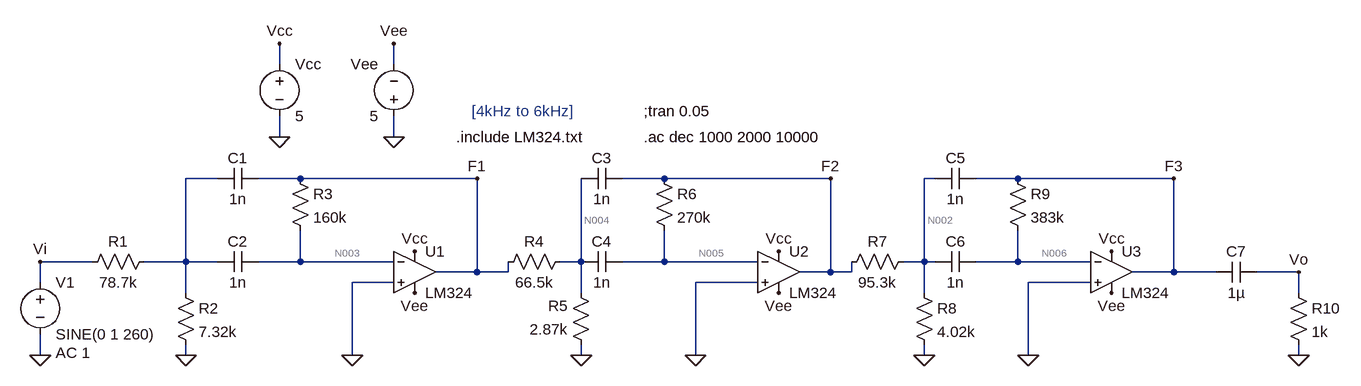
[diagram p0: schematic FinalPresenceFilter.asc]
FinalPresenceFilter.asc, the LTspice schematic file:
Version 4
SHEET 1 1524 680
WIRE -112 -160 -112 -192
WIRE 64 -160 64 -192
WIRE -112 -48 -112 -80
WIRE 64 -48 64 -80
WIRE -208 16 -256 16
WIRE -80 16 -144 16
WIRE 192 16 -80 16
WIRE 480 16 416 16
WIRE 736 16 480 16
WIRE 896 16 880 16
WIRE 1024 16 960 16
WIRE 1264 16 1024 16
WIRE -400 144 -480 144
WIRE -256 144 -256 16
WIRE -256 144 -320 144
WIRE -208 144 -256 144
WIRE -80 144 -80 96
WIRE -80 144 -144 144
WIRE 64 144 -80 144
WIRE 352 144 352 16
WIRE 352 144 320 144
WIRE 480 144 480 96
WIRE 480 144 416 144
WIRE 624 144 480 144
WIRE 880 144 880 16
WIRE 880 144 848 144
WIRE 896 144 880 144
WIRE 1024 144 1024 96
WIRE 1024 144 960 144
WIRE 1136 144 1024 144
WIRE 192 160 192 16
WIRE 192 160 128 160
WIRE 240 160 240 144
WIRE 240 160 192 160
WIRE 736 160 736 16
WIRE 736 160 688 160
WIRE 768 160 768 144
WIRE 768 160 736 160
WIRE 1264 160 1264 16
WIRE 1264 160 1200 160
WIRE 1328 160 1264 160
WIRE 1456 160 1392 160
WIRE -480 176 -480 144
WIRE 64 176 0 176
WIRE 624 176 528 176
WIRE 1136 176 1040 176
WIRE -256 192 -256 144
WIRE 352 192 352 144
WIRE 880 192 880 144
WIRE 1456 192 1456 160
WIRE -480 288 -480 256
WIRE -256 288 -256 272
WIRE 0 288 0 176
WIRE 352 288 352 272
WIRE 528 288 528 176
WIRE 880 288 880 272
WIRE 1040 288 1040 176
WIRE 1456 288 1456 272
FLAG 528 288 0
FLAG -480 288 0
FLAG 192 16 F1
FLAG 736 16 F2
FLAG -480 144 Vi
FLAG 1040 288 0
FLAG 1264 16 F3
FLAG 880 288 0
FLAG 352 288 0
FLAG -256 288 0
FLAG 0 288 0
FLAG -112 -192 Vcc
FLAG -112 -48 0
FLAG 64 -48 0
FLAG 64 -192 Vee
FLAG 96 192 Vee
FLAG 96 128 Vcc
FLAG 656 192 Vee
FLAG 656 128 Vcc
FLAG 1168 192 Vee
FLAG 1168 128 Vcc
FLAG 1456 288 0
FLAG 1456 160 Vo
SYMBOL res -304 128 R90
WINDOW 0 0 56 VBottom 2
WINDOW 3 32 56 VTop 2
SYMATTR InstName R1
SYMATTR Value 78.7k
SYMBOL voltage -480 160 R0
WINDOW 123 24 124 Left 2
WINDOW 39 0 0 Left 0
SYMATTR Value2 AC 1
SYMATTR InstName V1
SYMATTR Value SINE(0 1 260)
SYMBOL res -96 0 R0
SYMATTR InstName R3
SYMATTR Value 160k
SYMBOL res 336 128 R90
WINDOW 0 0 56 VBottom 2
WINDOW 3 32 56 VTop 2
SYMATTR InstName R4
SYMATTR Value 66.5k
SYMBOL res 368 288 R180
WINDOW 0 36 76 Left 2
WINDOW 3 36 40 Left 2
SYMATTR InstName R5
SYMATTR Value 2.87k
SYMBOL res 464 0 R0
SYMATTR InstName R6
SYMATTR Value 270k
SYMBOL res 752 160 R270
WINDOW 0 32 56 VTop 2
WINDOW 3 0 56 VBottom 2
SYMATTR InstName R7
SYMATTR Value 95.3k
SYMBOL res 864 176 R0
SYMATTR InstName R8
SYMATTR Value 4.02k
SYMBOL res 1008 0 R0
SYMATTR InstName R9
SYMATTR Value 383k
SYMBOL cap -144 0 R90
WINDOW 0 0 32 VBottom 2
WINDOW 3 32 32 VTop 2
SYMATTR InstName C1
SYMATTR Value 1n
SYMBOL cap -144 128 R90
WINDOW 0 0 32 VBottom 2
WINDOW 3 32 32 VTop 2
SYMATTR InstName C2
SYMATTR Value 1n
SYMBOL cap 416 0 R90
WINDOW 0 0 32 VBottom 2
WINDOW 3 32 32 VTop 2
SYMATTR InstName C3
SYMATTR Value 1n
SYMBOL cap 416 128 R90
WINDOW 0 0 32 VBottom 2
WINDOW 3 32 32 VTop 2
SYMATTR InstName C4
SYMATTR Value 1n
SYMBOL cap 960 0 R90
WINDOW 0 0 32 VBottom 2
WINDOW 3 32 32 VTop 2
SYMATTR InstName C5
SYMATTR Value 1n
SYMBOL cap 960 128 R90
WINDOW 0 0 32 VBottom 2
WINDOW 3 32 32 VTop 2
SYMATTR InstName C6
SYMATTR Value 1n
SYMBOL res -272 176 R0
SYMATTR InstName R2
SYMATTR Value 7.32k
SYMBOL voltage -112 -176 R0
WINDOW 123 0 0 Left 0
WINDOW 39 0 0 Left 0
SYMATTR InstName Vcc
SYMATTR Value 5
SYMBOL voltage 64 -64 R180
WINDOW 0 24 96 Left 2
WINDOW 3 24 16 Left 2
WINDOW 123 0 0 Left 0
WINDOW 39 0 0 Left 0
SYMATTR InstName Vee
SYMATTR Value 5
SYMBOL OpAmps\\opamp2 96 96 R0
SYMATTR InstName U1
SYMATTR Value LM324
SYMBOL OpAmps\\opamp2 656 96 R0
SYMATTR InstName U2
SYMATTR Value LM324
SYMBOL OpAmps\\opamp2 1168 96 R0
SYMATTR InstName U3
SYMATTR Value LM324
SYMBOL cap 1392 144 R90
WINDOW 0 0 32 VBottom 2
WINDOW 3 32 32 VTop 2
SYMATTR InstName C7
SYMATTR Value 1µ
SYMBOL res 1440 176 R0
SYMATTR InstName R10
SYMATTR Value 1k
TEXT 448 -88 Left 2 !;tran 0.05
TEXT 448 -48 Left 2 !.ac dec 1000 2000 10000
TEXT 184 -88 Left 2 ;[4kHz to 6kHz]
TEXT 160 -48 Left 2 !.include LM324.txt

The netlist it stands for:
* FinalPresenceFilter.asc
R1 N001 Vi 78.7k
V1 Vi 0 SINE(0 1 260) AC 1
R3 F1 N003 160k
R4 N004 F1 66.5k
R5 0 N004 2.87k
R6 F2 N005 270k
R7 F2 N002 95.3k
R8 N002 0 4.02k
R9 F3 N006 383k
C1 F1 N001 1n
C2 N003 N001 1n
C3 F2 N004 1n
C4 N005 N004 1n
C5 F3 N002 1n
C6 N006 N002 1n
R2 N001 0 7.32k
Vcc Vcc 0 5
Vee 0 Vee 5
XU1 0 N003 Vcc Vee F1 LM324  ; pins In+ In- V+ V- OUT
XU2 0 N005 Vcc Vee F2 LM324  ; pins In+ In- V+ V- OUT
XU3 0 N006 Vcc Vee F3 LM324  ; pins In+ In- V+ V- OUT
C7 Vo F3 1µ
R10 Vo 0 1k
;tran 0.05
.ac dec 1000 2000 10000
* [4kHz to 6kHz]
.include LM324.txt
.backanno
.end

* Results of the author's LTspice run, read from the files saved beside the schematic
* Operating Point, zero values left out:
*   V(f1) = -3.225 mV
*   V(n003) = -33.62 µV
*   V(n004) = -133.4 µV
*   V(f2) = -5.418 mV
*   V(n005) = -33.53 µV
*   V(n002) = -219.3 µV
*   V(f3) = -7.672 mV
*   V(n006) = -33.58 µV
*   V(vcc) = 5 V
*   V(vee) = -5 V
*   I(R9) = -19.94 nA
*   I(R8) = -54.56 nA
*   I(R7) = -54.56 nA
*   I(R6) = -19.94 nA
*   I(R5) = 46.49 nA
*   I(R4) = 46.49 nA
*   I(R3) = -19.94 nA
*   I(Vee) = -1.02 mA
*   I(Vcc) = -1.02 mA
*   Ix(u1:1) = -19.93 nA
*   Ix(u1:2) = -19.94 nA
*   Ix(u1:3) = 340 µA
*   Ix(u1:4) = -339.9 µA
*   Ix(u1:5) = 66.43 nA
*   Ix(u2:1) = -19.93 nA
*   Ix(u2:2) = -19.94 nA
*   Ix(u2:3) = 340 µA
*   Ix(u2:4) = -339.9 µA
*   Ix(u2:5) = 74.5 nA
*   Ix(u3:1) = -19.93 nA
*   Ix(u3:2) = -19.94 nA
*   Ix(u3:3) = 340 µA
*   Ix(u3:4) = -339.9 µA
*   Ix(u3:5) = 19.94 nA
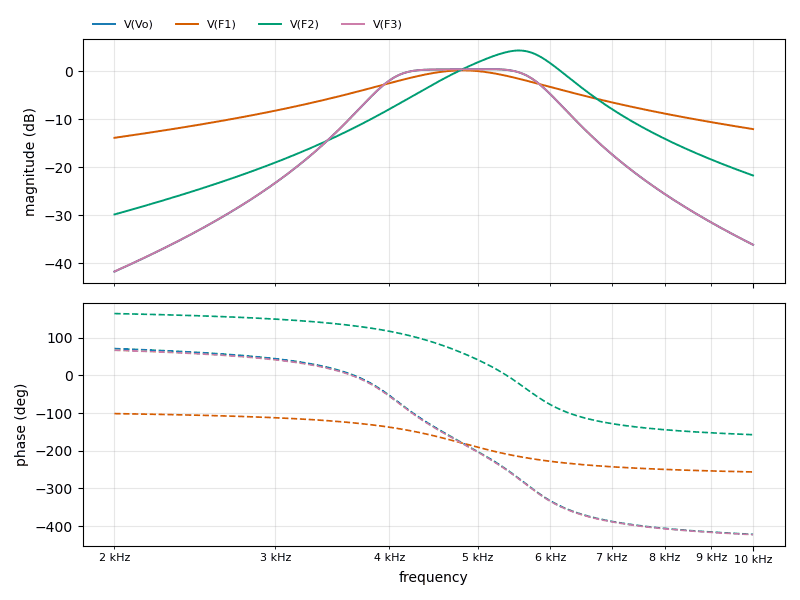
[diagram p1: AC Analysis of FinalPresenceFilter.asc, plotted from the saved traces]
* AC Analysis, 1 run:
*   V(Vo): -41.70 dB at 2 kHz, -36.12 dB at 10 kHz, peak 0.39 dB at 5.117 kHz, 3 dB below the peak at 3.957 kHz and 5.827 kHz
*   V(F1): -13.88 dB at 2 kHz, -12.07 dB at 10 kHz, peak 0.14 dB at 4.809 kHz, 3 dB below the peak at 3.936 kHz and 5.88 kHz
*   V(F2): -29.81 dB at 2 kHz, -21.72 dB at 10 kHz, peak 4.27 dB at 5.547 kHz, 3 dB below the peak at 4.92 kHz and 6.035 kHz
*   V(F3): -41.67 dB at 2 kHz, -36.11 dB at 10 kHz, peak 0.40 dB at 5.117 kHz, 3 dB below the peak at 3.957 kHz and 5.826 kHz